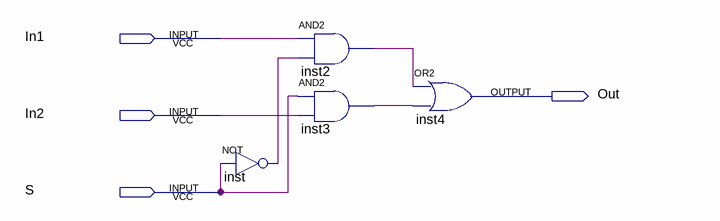
[diagram p0: schematic sheet]
// Quartus schematic mux2.bdf as structural Verilog: 4 symbols, 4 pins
module mux2 (
  input  In1,
  input  In2,
  input  S,
  output Out
);

  wire inst2_out, inst3_out, inst_out;

  not inst (inst_out, S);
  and inst2 (inst2_out, In1, inst_out);
  and inst3 (inst3_out, S, In2);
  or inst4 (Out, inst2_out, inst3_out);
endmodule
